# Altium schematic sheet Sheet2.SchDoc
size 420 x 297 mm; SheetNumber: 2; SheetTotal: 2
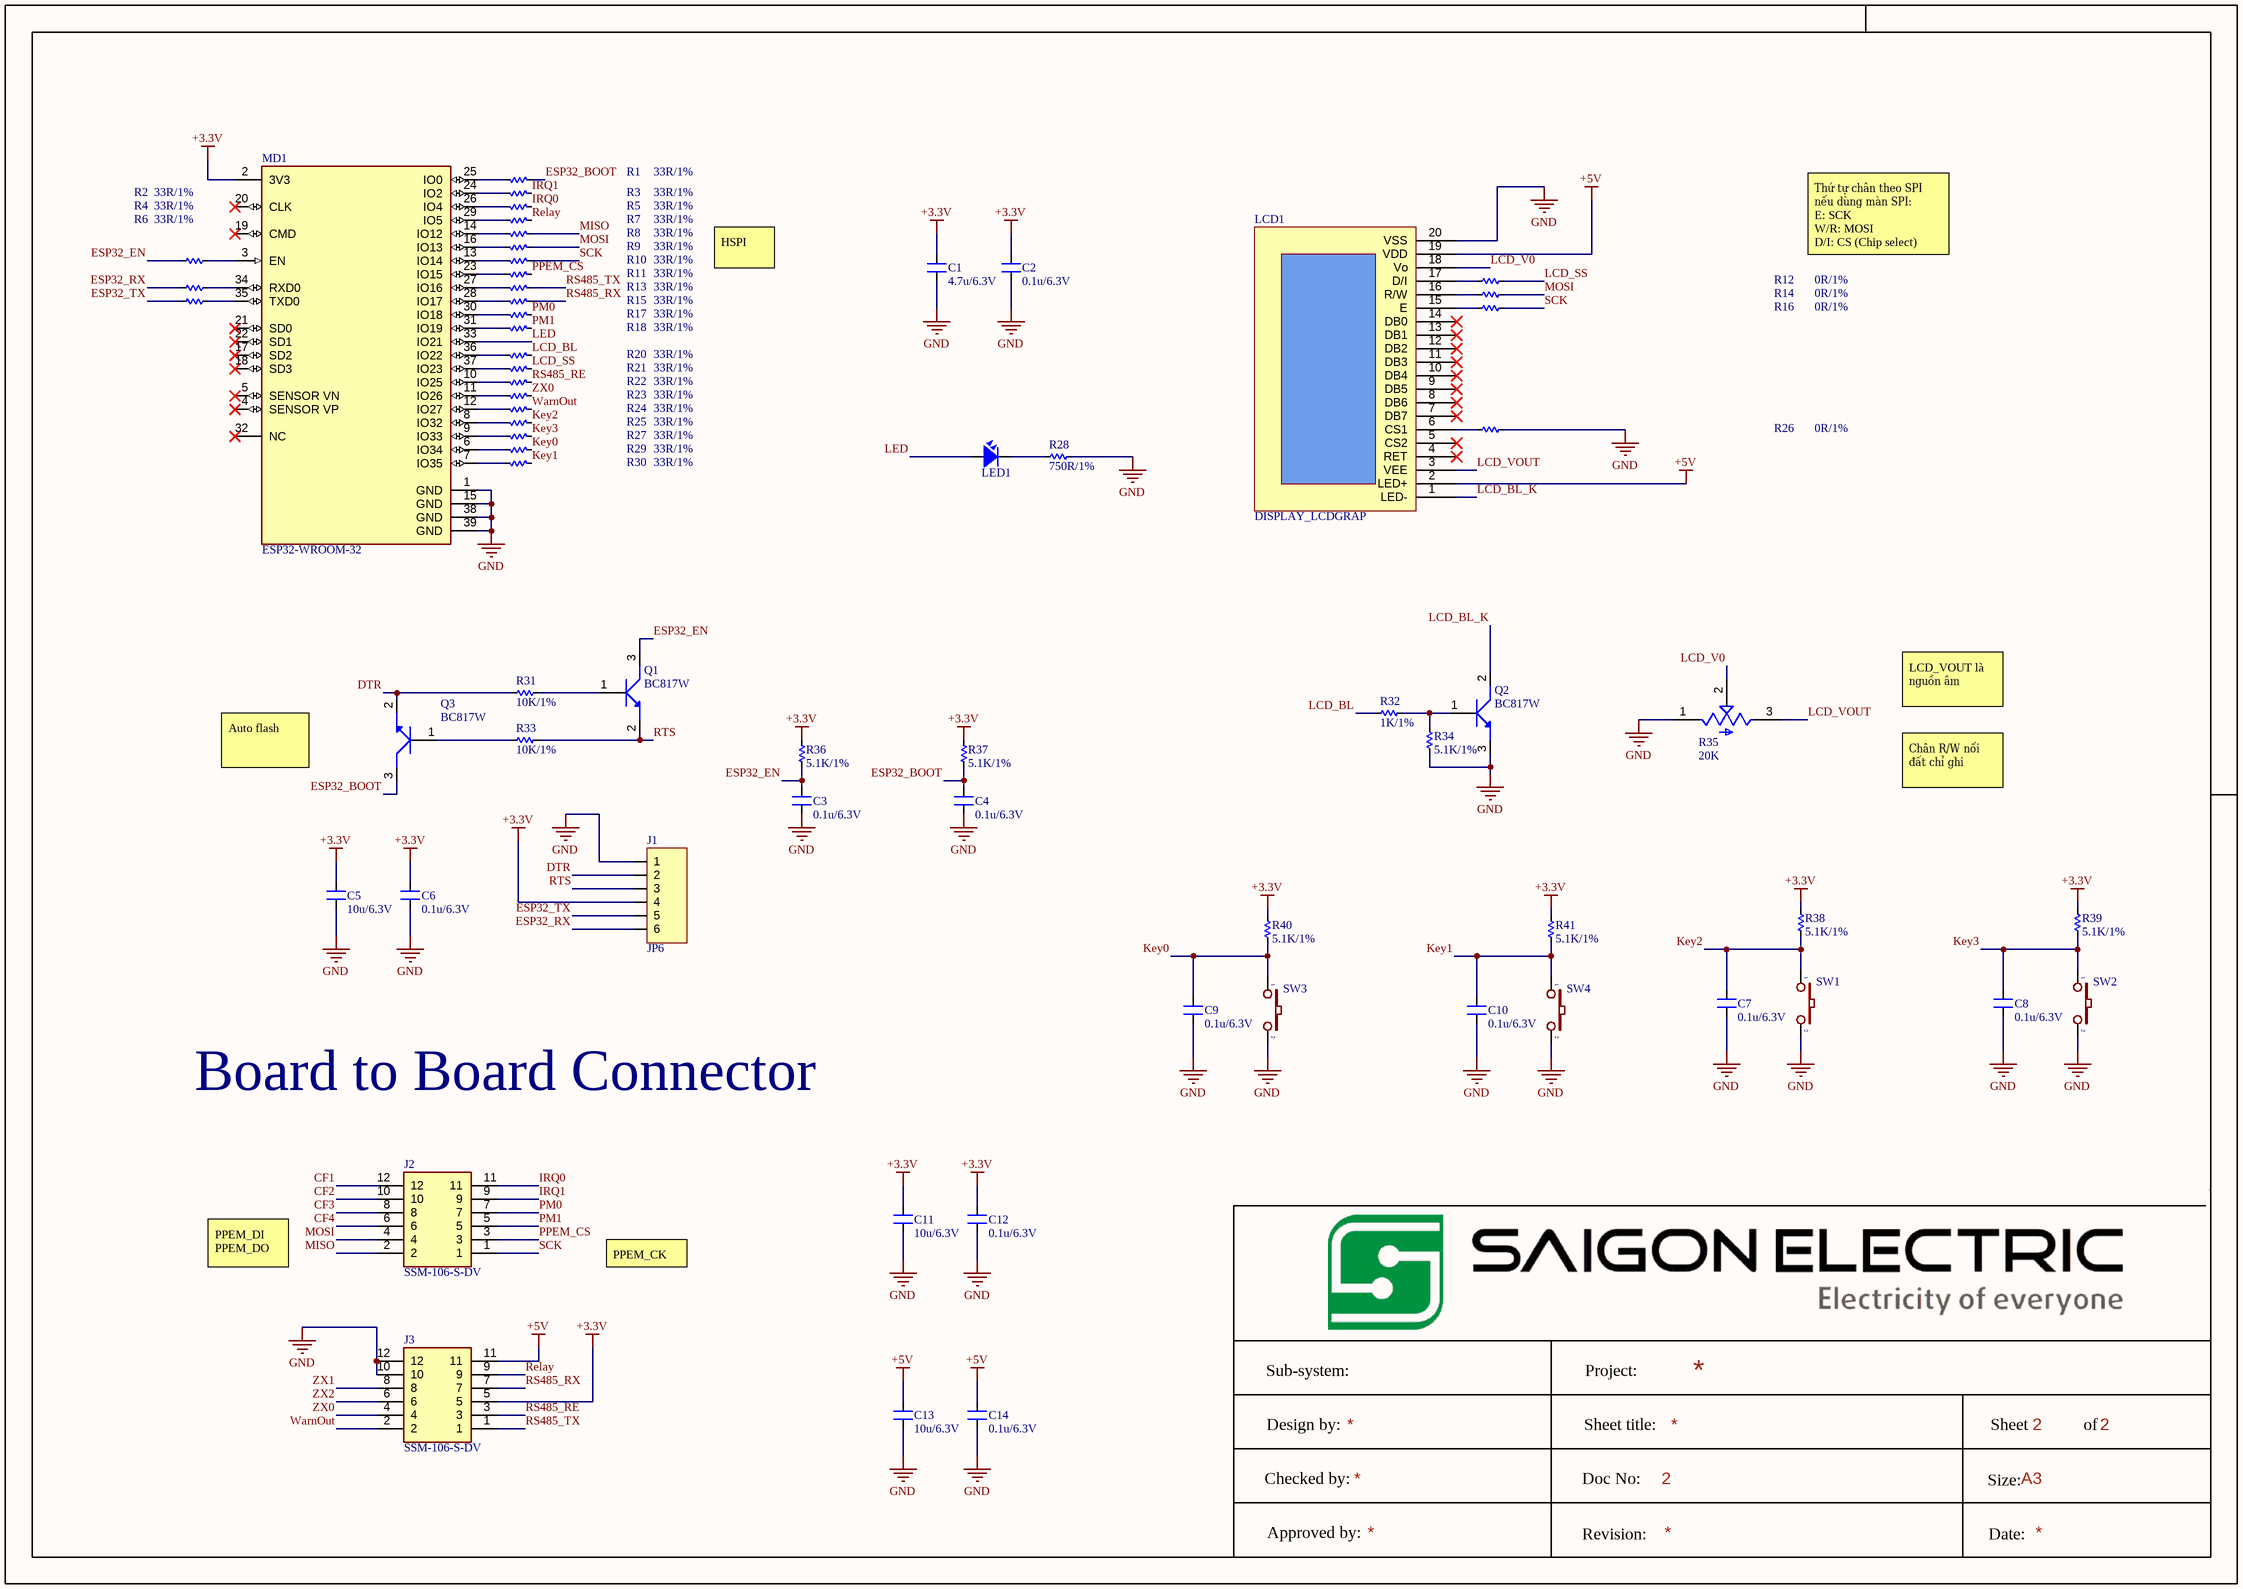
[diagram p0: Sheet2.SchDoc]

## Parts
C1  4.7u/6.3V  [CAP_C_2012X110]
C2  0.1u/6.3V  [CAP_C_2012X110]
C3  0.1u/6.3V  [CAP_C_2012X110]
C4  0.1u/6.3V  [CAP_C_2012X110]
C5  10u/6.3V  [CAP_C_2012X110]
C6  0.1u/6.3V  [CAP_C_2012X110]
C7  0.1u/6.3V  [CAP_C_2012X110]
C8  0.1u/6.3V  [CAP_C_2012X110]
C9  0.1u/6.3V  [CAP_C_2012X110]
C10  0.1u/6.3V  [CAP_C_2012X110]
C11  10u/6.3V  [CAP_C_2012X110]
C12  0.1u/6.3V  [CAP_C_2012X110]
C13  10u/6.3V  [CAP_C_2012X110]
C14  0.1u/6.3V  [CAP_C_2012X110]
J1  JP6  [JP6-C1C]
J2  SSM-106-S-DV  [SSM-106-XXX-DV-BE]
J3  SSM-106-S-DV  [SSM-106-XXX-DV-BE]
LCD1  DISPLAY_LCDGRAP  [LCD_GRAP_20PIN]
LED1  LED  [LED-0805-Blue]  (value not drawn)
MD1  ESP32-WROOM-32  [FP-ESP32-WROOM-32-MFG]
Q1  BC817W  [SOT95P237X112-3N]
Q2  BC817W  [SOT95P237X112-3N]
Q3  BC817W  [SOT95P237X112-3N]
R1  33R/1%  [RES_C_2012X65]
R2  33R/1%  [RES_C_2012X65]
R3  33R/1%  [RES_C_2012X65]
R4  33R/1%  [RES_C_2012X65]
R5  33R/1%  [RES_C_2012X65]
R6  33R/1%  [RES_C_2012X65]
R7  33R/1%  [RES_C_2012X65]
R8  33R/1%  [RES_C_2012X65]
R9  33R/1%  [RES_C_2012X65]
R10  33R/1%  [RES_C_2012X65]
R11  33R/1%  [RES_C_2012X65]
R12  0R/1%  [RES_C_2012X65]
R13  33R/1%  [RES_C_2012X65]
R14  0R/1%  [RES_C_2012X65]
R15  33R/1%  [RES_C_2012X65]
R16  0R/1%  [RES_C_2012X65]
R17  33R/1%  [RES_C_2012X65]
R18  33R/1%  [RES_C_2012X65]
R20  33R/1%  [RES_C_2012X65]
R21  33R/1%  [RES_C_2012X65]
R22  33R/1%  [RES_C_2012X65]
R23  33R/1%  [RES_C_2012X65]
R24  33R/1%  [RES_C_2012X65]
R25  33R/1%  [RES_C_2012X65]
R26  0R/1%  [RES_C_2012X65]
R27  33R/1%  [RES_C_2012X65]
R28  750R/1%  [RES_C_2012X65]
R29  33R/1%  [RES_C_2012X65]
R30  33R/1%  [RES_C_2012X65]
R31  10K/1%  [RES_C_2012X65]
R32  1K/1%  [RES_C_2012X65]
R33  10K/1%  [RES_C_2012X65]
R34  5.1K/1%  [RES_C_2012X65]
R35  20K  [TRIM_TC33X-2-103E]
R36  5.1K/1%  [RES_C_2012X65]
R37  5.1K/1%  [RES_C_2012X65]
R38  5.1K/1%  [RES_C_2012X65]
R39  5.1K/1%  [RES_C_2012X65]
R40  5.1K/1%  [RES_C_2012X65]
R41  5.1K/1%  [RES_C_2012X65]
SW1  (no value)  [SW2-SMD]
SW2  (no value)  [SW2-SMD]
SW3  (no value)  [SW2-SMD]
SW4  (no value)  [SW2-SMD]

## Nets
+3.3V: C1.2 C2.2 C5.2 C6.2 C11.2 C12.2 J1.4 J3.5 MD1.2(3V3) R36.2 R37.2 R38.2 R39.2 R40.2 R41.2
+5V: C13.2 C14.2 J3.11 LCD1.2(LED+) LCD1.19(VDD)
GND: C1.1 C2.1 C3.1 C4.1 C5.1 C6.1 C7.1 C8.1 C9.1 C10.1 C11.1 C12.1 C13.1 C14.1 J1.1 J3.10 J3.12 LCD1.20(VSS) MD1.1(GND) MD1.15(GND) MD1.38(GND) MD1.39(GND) Q2.3(C) R26.2 R28.2 R34.1 R35.1(CCW) SW1.2 SW2.2 SW3.2 SW4.2
CF1: J2.12
CF2: J2.10
CF3: J2.8
CF4: J2.6
DTR: J1.2 Q3.2(E) R31.2
ESP32_BOOT: C4.2 Q3.3(C) R1.2 R37.1
ESP32_EN: C3.2 Q1.3(C) R2.2 R36.1
ESP32_RX: J1.6 R4.2
ESP32_TX: J1.5 R6.2
IRQ0: J2.11 R5.2
IRQ1: J2.9 R3.2
Key0: C9.2 R29.2 R40.1 SW3.1
Key1: C10.2 R30.2 R41.1 SW4.1
Key2: C7.2 R25.2 R38.1 SW1.1
Key3: C8.2 R27.2 R39.1 SW2.1
LCD_BL: R20.2 R32.1
LCD_BL_K: LCD1.1(LED-) Q2.2(E)
LCD_SS: R12.2 R21.2
LCD_V0: LCD1.18(Vo) R35.2(W)
LCD_VOUT: LCD1.3(VEE) R35.3(CW)
LED: LED1.1 MD1.33(IO21)
MISO: J2.2 R8.2
MOSI: J2.4 R9.2 R14.2
PM0: J2.7 R17.2
PM1: J2.5 R18.2
PPEM_CS: J2.3 R11.2
Relay: J3.9 R7.2
RS485_RE: J3.3 R22.2
RS485_RX: J3.7 R15.2
RS485_TX: J3.1 R13.2
RTS: J1.3 Q1.2(E) R33.1
SCK: J2.1 R10.2 R16.2
WarnOut: J3.2 R24.2
ZX0: J3.4 R23.2
ZX1: J3.8
ZX2: J3.6
NetLCD1_6: LCD1.6(CS1) R26.1
NetLCD1_15: LCD1.15(E) R16.1
NetLCD1_16: LCD1.16(R/W) R14.1
NetLCD1_17: LCD1.17(D/I) R12.1
NetLED1_2: LED1.2 R28.1
NetMD1_3: MD1.3(EN) R2.1
NetMD1_6: MD1.6(IO34) R29.1
NetMD1_7: MD1.7(IO35) R30.1
NetMD1_8: MD1.8(IO32) R25.1
NetMD1_9: MD1.9(IO33) R27.1
NetMD1_10: MD1.10(IO25) R22.1
NetMD1_11: MD1.11(IO26) R23.1
NetMD1_12: MD1.12(IO27) R24.1
NetMD1_13: MD1.13(IO14) R10.1
NetMD1_14: MD1.14(IO12) R8.1
NetMD1_16: MD1.16(IO13) R9.1
NetMD1_23: MD1.23(IO15) R11.1
NetMD1_24: MD1.24(IO2) R3.1
NetMD1_25: MD1.25(IO0) R1.1
NetMD1_26: MD1.26(IO4) R5.1
NetMD1_27: MD1.27(IO16) R13.1
NetMD1_28: MD1.28(IO17) R15.1
NetMD1_29: MD1.29(IO5) R7.1
NetMD1_30: MD1.30(IO18) R17.1
NetMD1_31: MD1.31(IO19) R18.1
NetMD1_34: MD1.34(RXD0) R4.1
NetMD1_35: MD1.35(TXD0) R6.1
NetMD1_36: MD1.36(IO22) R20.1
NetMD1_37: MD1.37(IO23) R21.1
NetQ1_1: Q1.1(B) R31.1
NetQ2_1: Q2.1(B) R32.2 R34.2
NetQ3_1: Q3.1(B) R33.2

Not connected (* = marked no-connect by the designer): LCD1 4(RET)* 5(CS2)* 7(DB7)* 8(DB6)* 9(DB5)* 10(DB4)* 11(DB3)* 12(DB2)* 13(DB1)* 14(DB0)*; MD1 4(SENSOR_VP)* 5(SENSOR_VN)* 17(SD2)* 18(SD3)* 19(CMD)* 20(CLK)* 21(SD0)* 22(SD1)* 32(NC)*

## Notes on the sheet
- HSPI
- Thứ tự chân theo SPI nếu dùng màn SPI:
  E: SCK
  W/R: MOSI
  D/I: CS (Chip select)
- LCD_VOUT là nguồn âm
- Auto flash
- Chân R/W nối đất chỉ ghi
- Board to Board Connector
- PPEM_DI PPEM_DO
- PPEM_CK
- Sub-system:
- Project:
- Design by:
- Sheet title:
- Sheet
- of
- Checked by:
- Approved by:
- Doc No:
- Revision:
- Size:
- Date:
- A3

## Library data of the parts
C1-C14 = CAP_SMD
J1 = JP6: WR-PHD 2.54 mm Angled Socket Header; Manufacturer: W¨¹rth Elektronik eiSos GmbH; partNo: 613006143121; ComponentLink1 Description: Manufacturer; ComponentLink2 Description: Datasheet; NoPins: 06; Created Date: 29 March 2013; ComponentLink1URL: http://www.we-online.com; ComponentLink2URL: http://katalog.we-online.de/em/datasheet/6130xx143121.pdf; Created by: Karrer Zheng
J2 J3 = SSM-106-S-DV: Connector; Manufacturer_Name: SAMTEC; Manufacturer_Part_Number: SSM-105-S-DV; Datasheet Link: https://mm.digikey.com/Volume0/opasdata/d220001/medias/docus/6129/ssm-1xx-xxx-dv-xx-xx-xxx-x-xx-mkt.pdf; Mouser Part Number: 200-SSM105SDV; Mouser Price/Stock: https://www.mouser.co.uk/ProductDetail/Samtec/SSM-105-S-DV?qs=XtX6y9BSeMiNY1vJI%2FFCQQ%3D%3D; Arrow Part Number: SSM-105-S-DV; Arrow Price/Stock: https://www.arrow.com/en/products/ssm-105-s-dv/samtec; LCSC Part #: *
LCD1 = DISPLAY_LCDGRAP: Display 128x64pixel; Manufacturer: Newhaven Display; Manufacturer Part Number: NHD-12864AZ-NSW-BBW-TR; Supplier: Digikey; Supplier Part Number: NHD-12864AZ-NSW-BBW-TR-ND; RoHS: No; Category: LCD, OLED, Graphic Displays; Stock: 303; Pricing: 1=31,34, 5=29,46, 10=27,579, 50=26,0124, 100=24,7588, 250=23,50516 (USD); ComponentLink1URL: https://datasheet.ciiva.com:443/pdfs/VipMasterIC/IC/NWAL/NWALS00082/NWALS00082-1.pdf?src-supplier=IHS+Markit; ComponentLink1Description: https://datasheet.ciiva.com:443/pdfs/VipMasterIC/IC/NWAL/NWALS00082/NWALS00082-1.pdf?src-supplier=IHS+Markit; ComponentLink2URL: https://datasheet.ciiva.com/2102/nhd-12864az-nsw-bbw-tr-2102907.pdf?src-supplier=Digikey; ComponentLink2Description: https://datasheet.ciiva.com/2102/nhd-12864az-nsw-bbw-tr-2102907.pdf?src-supplier=Digikey; ComponentLink3URL: https://datasheet.ciiva.com/16231/nhd-12864az-nsw-bbw-tr-16231892.pdf?src-supplier=Onlinecomponents.com; ComponentLink3Description: https://datasheet.ciiva.com/16231/nhd-12864az-nsw-bbw-tr-16231892.pdf?src-supplier=Onlinecomponents.com; ComponentLink4URL: https://datasheet.ciiva.com/5326/nhd-12864az-nsw-bbw-tr-52487-5326437.pdf?src-supplier=Mouser; ComponentLink4Description: https://datasheet.ciiva.com/5326/nhd-12864az-nsw-bbw-tr-52487-5326437.pdf?src-supplier=Mouser; ComponentLink5URL: https://datasheet.ciiva.com/30204/nhd-12864az-nsw-bbw-tr-30204634.pdf?src-supplier=Onlinecomponents.com; ComponentLink5Description: https://datasheet.ciiva.com/30204/nhd-12864az-nsw-bbw-tr-30204634.pdf?src-supplier=Onlinecomponents.com
LED1 = LED SMD: Value: LED 3 - 5 ly 2 Colour
MD1 = CMP-194065-000008-1: RX TXRX MOD WIFI SURFACE MOUNT; Frequency: 2.5GHz; Sensitivity: -98dBm; Operating Supply Voltage: 3.6V; Data Rate: 150Mbps; Weight: 0.088185oz; Package Quantity: 550; Min Operating Temperature: -40°C; Mount: Surface Mount; Max Operating Temperature: 85°C; Packaging: Cut Tape; Case/Package: SMD/SMT
Q1-Q3 = BJT_NPN
  Q1 Q3: LCSC Part #: *
R1-R18 R20-R34 R36-R41 = Res-SMD: Resistor; Manufacturer: Generic Components; Class: Passive; Published: 08/06/2000; Publisher: Altium Hobart Technology Centre
R35 = TC33X-2-103E: 10 kOhms 0.1W, 1/10W J Lead Surface Mount Trimmer Potentiometer Cermet 1 Turn Top Adjustment; MF: Bourns; MP: TC33X-2-103E; SnapEDA_Link: https://www.snapeda.com/parts/TC33X-2-103E/Bourns/view-part/47092/?ref=snap; Package: SOD-23 Bourns; Check_prices: https://www.snapeda.com/parts/TC33X-2-103E/Bourns/view-part/47092/?ref=eda; Value: *; Purchase-URL: https://pricing.snapeda.com/search/part/TC33X-2-103E/?ref=eda; Digi-Key_Part_Number: TC33X-103ECT-ND
SW1-SW4 = SW2: Switch button 2 pin; pin to pad: 1>1+4 2>2+3; Value: SW chip 2 pin